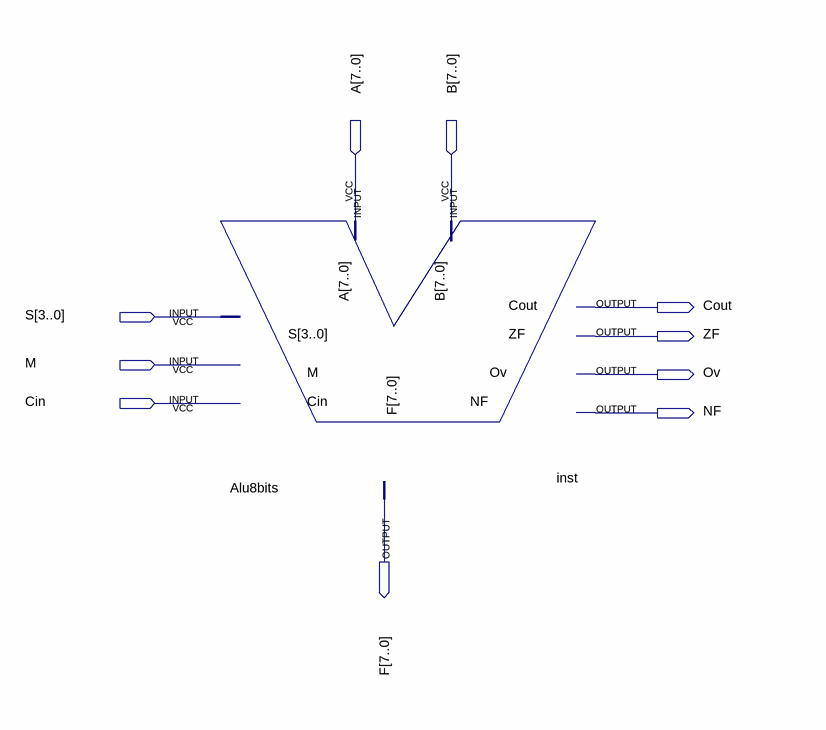
[diagram p0: schematic sheet]
// Quartus schematic TestALUs3.bdf as structural Verilog: 1 symbols, 10 pins
module TestALUs3 (
  input  [7:0] A,
  input  [7:0] B,
  input  [3:0] S,
  input  M,
  input  Cin,
  output Cout,
  output ZF,
  output Ov,
  output NF,
  output [7:0] F
);

  Alu8bits inst (.A(A), .B(B), .S(S), .M(M), .Cin(Cin), .F(F), .Cout(Cout), .ZF(ZF), .Ov(Ov), .NF(NF));
endmodule
